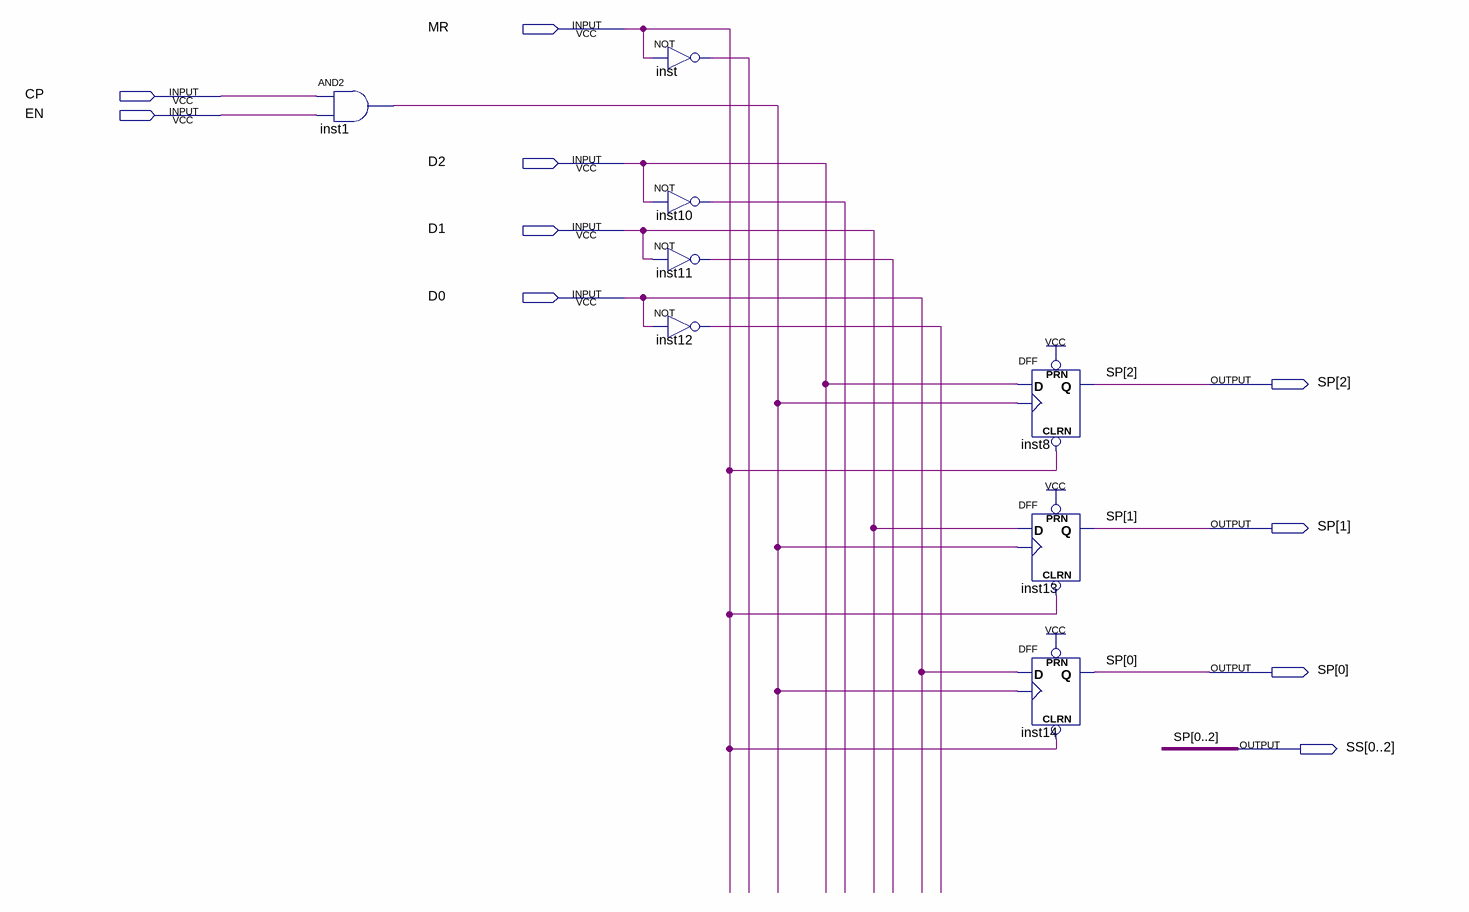
[diagram p0: schematic sheet]
// Quartus schematic Registrador.bdf as structural Verilog: 8 symbols, 10 pins
module Registrador (
  input  MR,
  input  CP,
  input  EN,
  input  D2,
  input  D1,
  input  D0,
  output [2:0] SP,
  output [0:2] SS
);

  wire inst1_out, inst10_out, inst11_out, inst12_out, inst_out;

  and inst1 (inst1_out, CP, EN);
  not inst (inst_out, MR);
  not inst10 (inst10_out, D2);
  not inst11 (inst11_out, D1);
  not inst12 (inst12_out, D0);
  DFF inst8 (.CLRN(MR), .CLK(inst1_out), .D(D2), .PRN(1'b1), .Q(SP[2]));
  DFF inst13 (.CLRN(MR), .CLK(inst1_out), .D(D1), .PRN(1'b1), .Q(SP[1]));
  DFF inst14 (.CLRN(MR), .CLK(inst1_out), .D(D0), .PRN(1'b1), .Q(SP[0]));

  assign SS = {SP[0], SP[1], SP[2]};
endmodule
